# EAGLE design Preamp_Prueba (EAGLE 7.7.0)
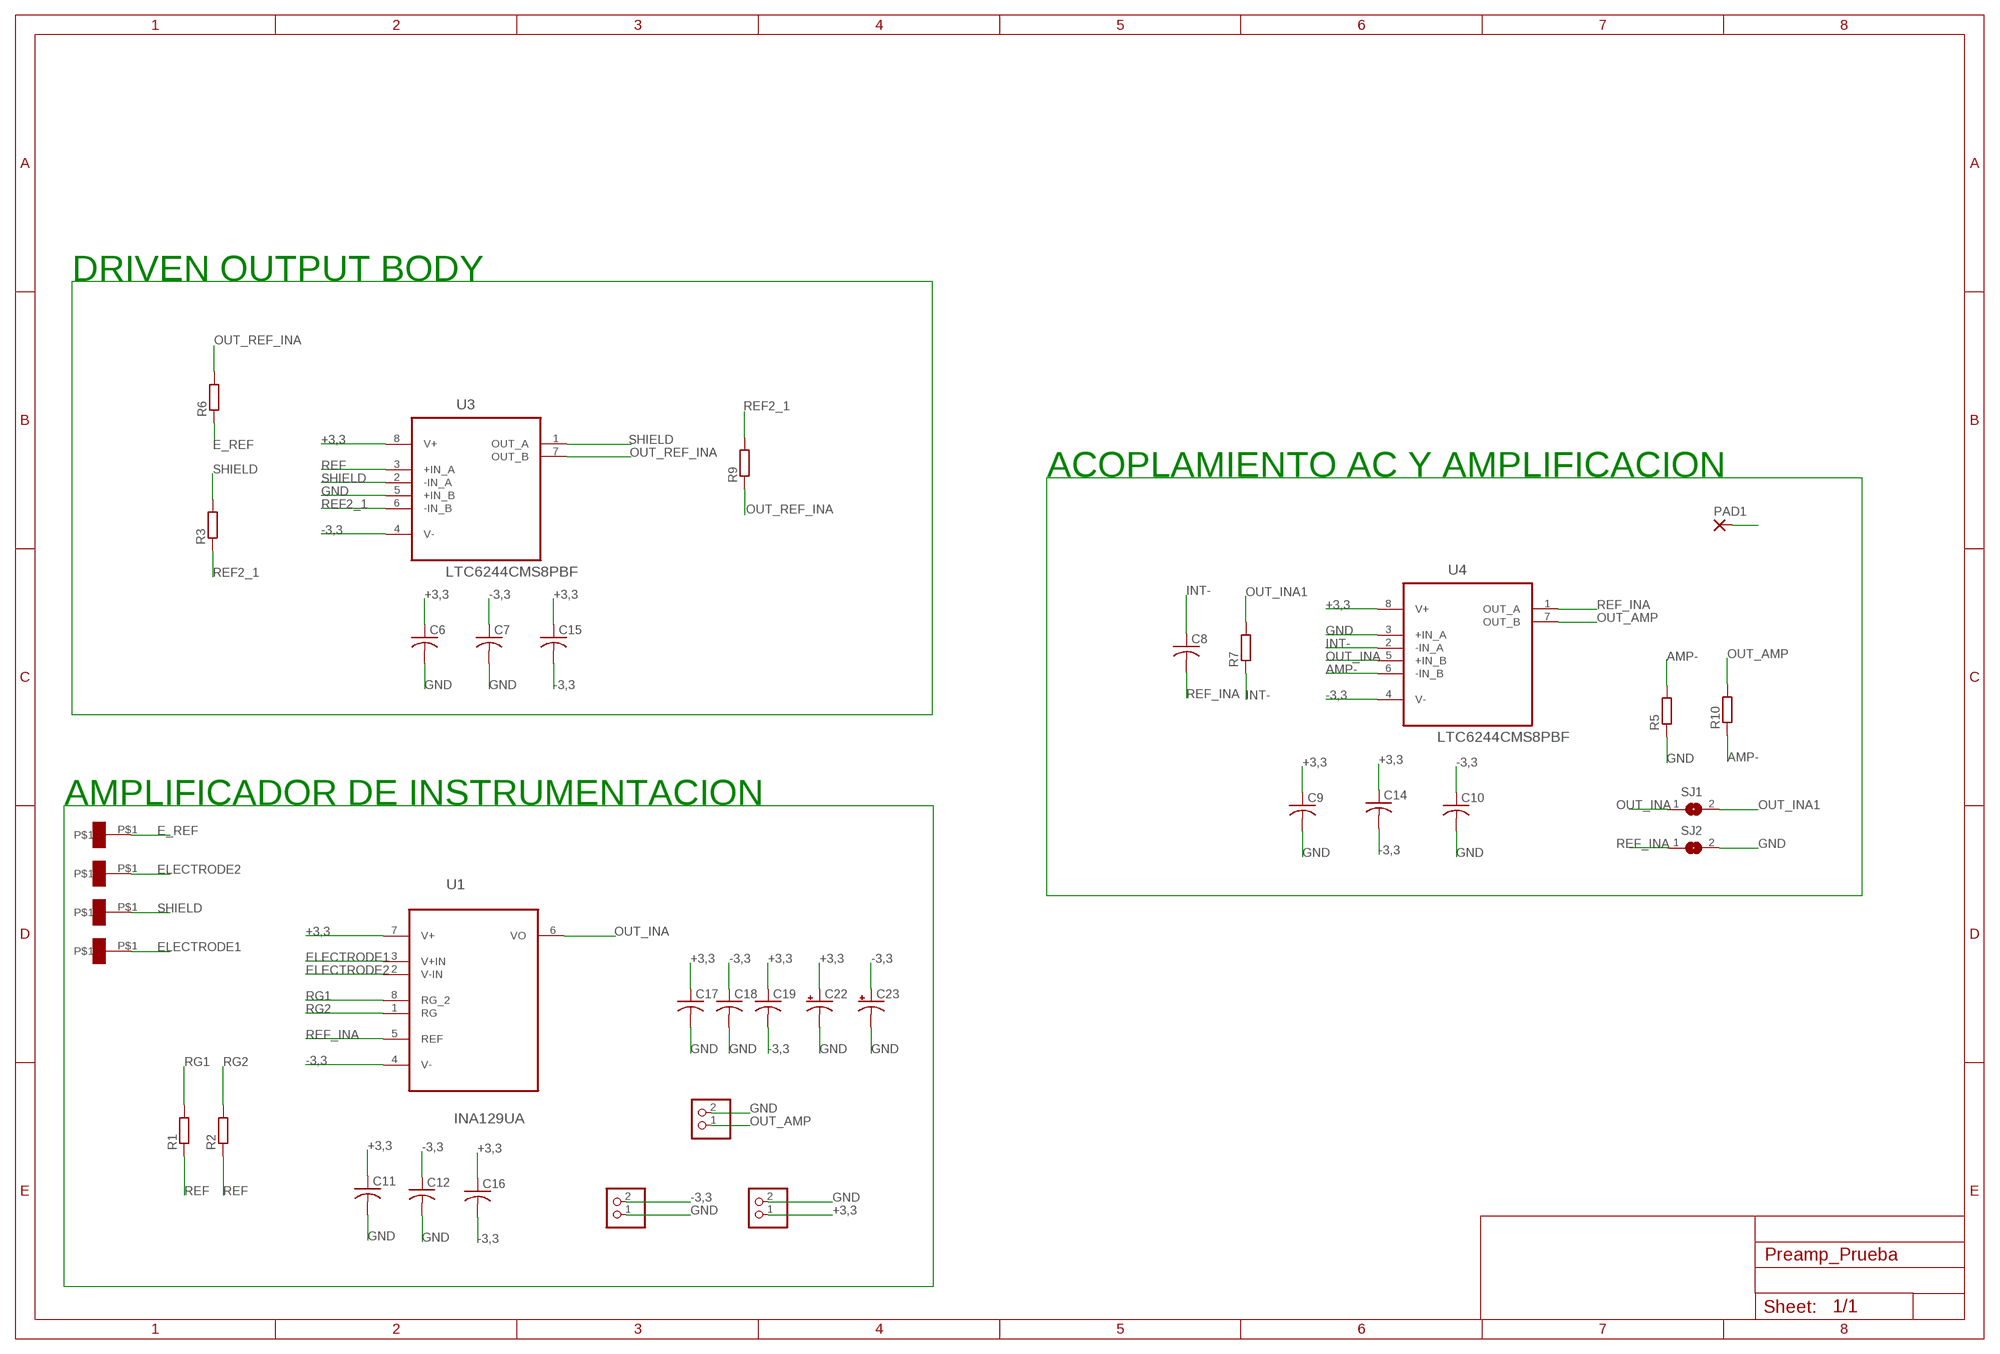
[diagram p0: schematic, sheet 1]

## Parts
C6  C-USC0805  [C0805]
C7  C-USC0805  [C0805]
C8  C-USC0805  [C0805]
C9  C-USC0805  [C0805]
C10  C-USC0805  [C0805]
C11  C-USC0805  [C0805]
C12  C-USC0805  [C0805]
C14  C-USC0805  [C0805]
C15  C-USC0805  [C0805]
C16  C-USC0805  [C0805]
C17  C-USC0805  [C0805]
C18  C-USC0805  [C0805]
C19  C-USC0805  [C0805]
C22  CPOL-USB/3528-21W  [B/3528-21W]
C23  CPOL-USB/3528-21W  [B/3528-21W]
JP1  PINHD-1X2  [1X02]
JP2  PINHD-1X2  [1X02]
JP5  PINHD-1X2  [1X02]
PAD1  SMD2  [SMD1,27-2,54]
R1  R-EU_R0805  [R0805]
R2  R-EU_R0805  [R0805]
R3  R-EU_R0805  [R0805]
R5  R-EU_R0805  [R0805]
R6  R-EU_R0805  [R0805]
R7  R-EU_R0805  [R0805]
R9  R-EU_R0805  [R0805]
R10  R-EU_R0805  [R0805]
SJ1  SJ  [SJ]
SJ2  SJ  [SJ]
U1  INA129UA  [SOIC127P600X175-8N]
U3  LTC6244CMS8PBF  [SOP65P490X110-8N]
U4  LTC6244CMS8PBF  [SOP65P490X110-8N]
U$1  PIN_E  [PIN]
U$2  PIN_E  [PIN]
U$3  PIN_E  [PIN]
U$4  PIN_E  [PIN]

## Nets
+3,3: C6.1 C9.1 C11.1 C14.1 C15.1 C16.1 C17.1 C19.1 C22.+ JP2.1 U1.7(V+) U3.8(V+) U4.8(V+)
-3,3: C7.1 C10.1 C12.1 C14.2 C15.2 C16.2 C18.1 C19.2 C23.+ JP1.2 U1.4(V-) U3.4(V-) U4.4(V-)
AMP-: R5.2 R10.1 U4.6(-IN_B)
E_REF: R6.1 U$3.P$1
ELECTRODE1: U1.3(V+IN) U$4.P$1
ELECTRODE2: U1.2(V-IN) U$2.P$1
GND: C6.2 C7.2 C9.2 C10.2 C11.2 C12.2 C17.2 C18.2 C22.- C23.- JP1.1 JP2.2 JP5.2 PAD1.1(P) R5.1 SJ2.2 U3.5(+IN_B) U4.3(+IN_A)
INT-: C8.1 R7.1 U4.2(-IN_A)
OUT_AMP: JP5.1 R10.2 U4.7(OUT_B)
OUT_INA: SJ1.1 U1.6(VO) U4.5(+IN_B)
OUT_INA1: R7.2 SJ1.2
OUT_REF_INA: R6.2 R9.1 U3.7(OUT_B)
REF: R1.1 R2.1 U3.3(+IN_A)
REF2_1: R3.1 R9.2 U3.6(-IN_B)
REF_INA: C8.2 SJ2.1 U1.5(REF) U4.1(OUT_A)
RG1: R1.2 U1.8(RG_2)
RG2: R2.2 U1.1(RG)
SHIELD: R3.2 U3.1(OUT_A) U3.2(-IN_A) U$1.P$1

## Notes on the sheet
- DRIVEN OUTPUT BODY
- ACOPLAMIENTO AC Y AMPLIFICACION
- AMPLIFICADOR DE INSTRUMENTACION

## Library data of the parts
C6-C12 C14-C19 = resistor:C-US: CAPACITOR, American symbol
C22 C23 = rcl:CPOL-US: POLARIZED CAPACITOR, American symbol
JP1 JP2 JP5 = pinhead:PINHD-1X2: PIN HEADER
PAD1 = wirepad:SMD2: SMD PAD
R1-R3 R5-R7 R9 R10 = resistor:R-EU_: RESISTOR, European symbol
SJ1 SJ2 = jumper:SJ: SMD solder JUMPER
U1 = INA129UA:INA129UA: INSTRUMENTATION AMPLIFIER; AVAILABILITY: Good; DESCRIPTION: Precision, Low Power Instrumentation Amplifiers 8-SOIC -40 to 125; MF: Texas Instruments; MP: INA129UA; PACKAGE: SOIC-8 Texas Instruments; PRICE: 5.97 USD
U3 U4 = LTC6244CMS8PBF:LTC6244CMS8PBF: Dual 50MHz, Low Noise,Rail-to-Rail, CMOS Op Amp; AVAILABILITY: Good; DESCRIPTION: LTC6244 - Dual 50MHz, Low Noise, Rail-to-Rail, CMOS Op Amp; MF: Linear Technology; MP: LTC6244CMS8#PBF; PACKAGE: MSOP-8 Linear Technology; PRICE: 2.34 USD
U$1-U$4 = pin_esa_vuelta:PIN_E

## Board
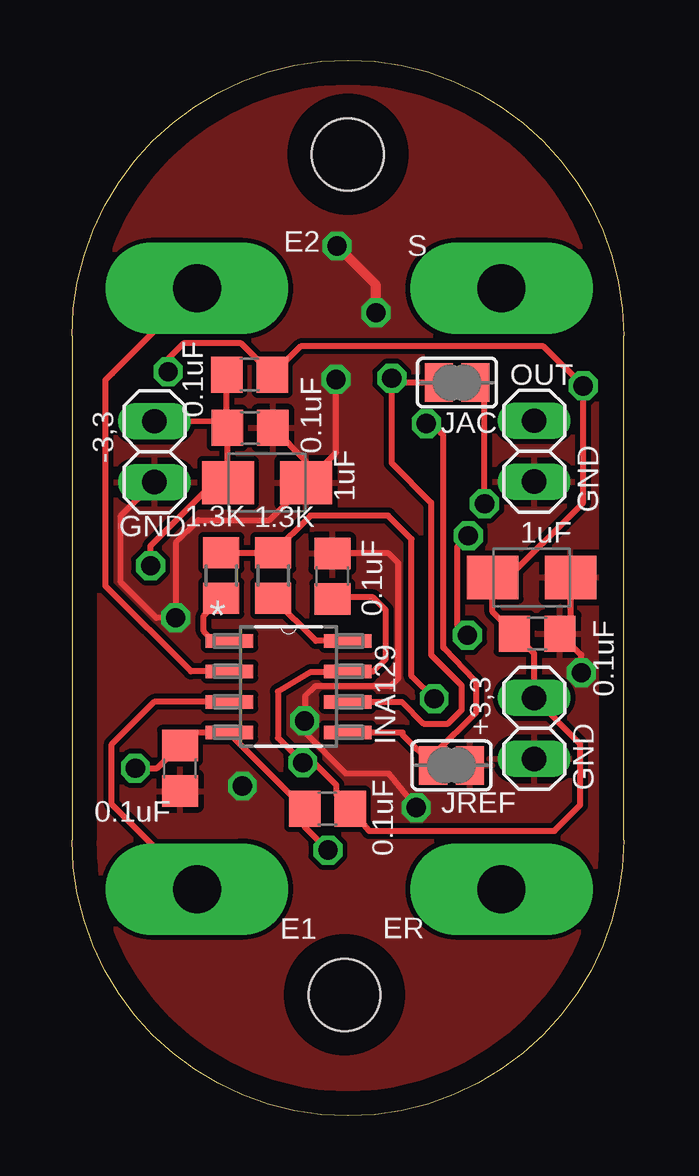
[diagram p1: board, top side]
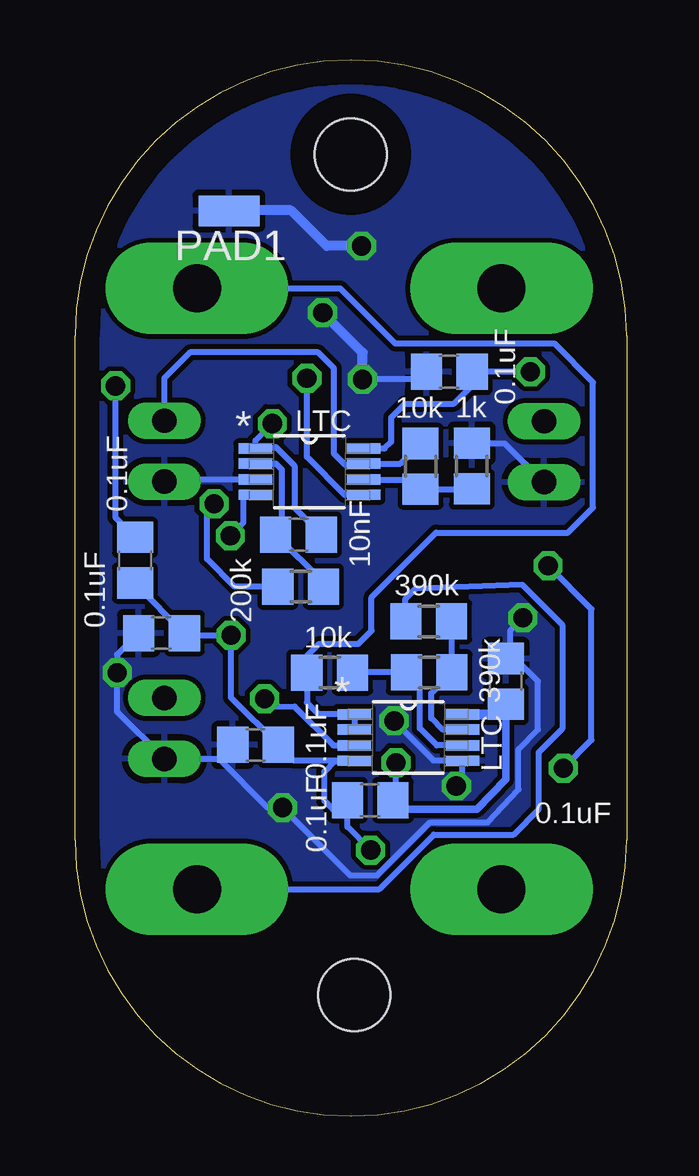
[diagram p2: board, bottom side, seen from below]

Size 23 x 44 mm. Coordinates in mm from the lower left corner, seen from the top.
Outline: 0,32.5 0,11.5 arc180 23,11.5 23,32.5 arc180 0,32.5
Copper layers (1*16): Top 0.035mm / dielectric 1.5mm / Bottom 0.035mm
Design rules "default": minimum track width 10mil, minimum drill 24mil, track to track 8mil, track to pad 8mil, pad to pad 8mil, via to via 8mil, smd to smd 8mil, copper to edge 40mil, drill to drill 8mil, minimum pad ring 10mil, minimum via ring 8mil, stop-mask expansion 4mil, vias tented up to drill 0mil, thermal gap 10mil
Holes 3 mm at 11.36,5.05 11.5,40.07

### Footprints (pad centres in the part's own frame; a part is rotated, then mirrored left to right if it is on the bottom)
C0805 = smd 1.3 x 1.5: 1 -0.95,0; 2 0.95,0
B/3528-21W = smd 2.15 x 1.8: + 1.625,0; - -1.625,0
1X02 = drill 1.016 long: 1 -1.27,0; 2 1.27,0
SMD1,27-2,54 = smd 1.27 x 2.54: 1 0,0
R0805 = smd 1.3 x 1.5: 1 -0.95,0; 2 0.95,0
SJ = smd 1.168 x 1.6: 1 -0.762,0; 2 0.762,0
SOIC127P600X175-8N = smd 1.981 x 0.559: 1 -2.464,1.905; 2 -2.464,0.635; 3 -2.464,-0.635; 4 -2.464,-1.905; 5 2.464,-1.905; 6 2.464,-0.635; 7 2.464,0.635; 8 2.464,1.905
SOP65P490X110-8N = smd 1.397 x 0.432: 1 -2.261,0.965; 2 -2.261,0.33; 3 -2.261,-0.33; 4 -2.261,-0.965; 5 2.261,-0.965; 6 2.261,-0.33; 7 2.261,0.33; 8 2.261,0.965
PIN = drill 2 pad 3.81 long: P$1 0,0

### Placement (x,y rotation side)
C6  5.04,18.11 90 bottom
C7  15.47,15.46 180 bottom
C8  13.68,24.22 0 bottom
C9  7.39,31.01 180 bottom
C10  19.39,20.12 180 bottom
C11  19.39,20.1 0 top
C12  4.5,14.49 270 top
C14  20.49,23.16 270 bottom
C15  10.69,13.16 180 bottom
C16  10.65,12.8 180 top
C17  10.85,22.49 90 top
C18  7.42,28.67 0 top
C19  7.4,30.89 180 top
C22  19.16,22.44 180 top
C23  8.13,26.39 180 top
JP1  3.44,27.68 90 top
JP2  19.27,16.15 270 top
JP5  19.27,27.7 270 top
PAD1  16.58,37.71 90 bottom
R1  8.39,22.52 270 top
R2  6.22,22.52 270 top
R3  12.38,18.47 180 bottom
R5  6.45,27.08 270 bottom
R6  8.25,20.61 0 bottom
R7  13.59,22.06 180 bottom
R9  8.23,18.48 180 bottom
R10  8.59,27.07 90 bottom
SJ1  16.05,30.56 0 top
SJ2  15.82,14.61 0 top
U1  9.03,17.89 0 top
U3  9.1,15.77 0 bottom
U4  13.22,26.85 0 bottom
U$1  17.91,34.48 180 top
U$2  5.21,34.48 180 top
U$3  17.91,9.45 0 top
U$4  5.21,9.45 0 top

### Tracks (layer width: path | path; a pad name or v marks a point on that pad's centre or on a via)
+3,3  (via drill 0.8)
  Top 0.254: C17.1 10.92,21.61 12.55,21.61 13.08,21.08 13.08,19.04 12.56,18.52 U1.7 11.47,18.5 9.95,18.5 8.58,17.69 8.58,15.76 v9.62,14.72 10.09,14.72 11.01,13.8 11.01,13.39 C16.1 | 11.64,12.84 C16.1 | 11.6,12.88 C16.1 | 11.54,12.8 C16.1 | C16.1 12.39,11.88 20.11,11.88 21.18,12.95 21.18,15.51 JP2.1 19.27,19.27 C11.1 17.54,21 C22.+ 17.86,22.08 17.86,22.11 21.31,25.56 v21.31,30.42 19.66,32.07 9.53,32.07 C19.1 7.05,32.19 4.65,32.19 4.01,31.55 v4.01,31.01
  Bottom 0.254: 9.72,12.74 C15.1 9.62,12.92 v9.62,14.72 | U4.8 10.09,27.82 9.81,28.09 9.81,29.11 9.24,29.68 7.19,29.68 6.47,30.4 6.47,30.98 C9.1 v4.01,31.01 | U3.8 6.05,16.73 | C14.1 21.31,24.93 v21.31,30.42
  Bottom 0.305: C6.1 5.04,14.03 6.25,12.79 9.71,12.79 C15.1
  Bottom 0.406: 6.05,16.73 5.05,16.73 C6.1
-3,3  (via drill 0.8)
  Top 0.254: 9.68,12.78 C16.2 | JP1.2 6.17,28.97 | 6.17,28.97 C18.1 6.47,26.43 C23.+ 5.9,26.39 3.27,23.76 v3.27,22.93 | v16.49,20.03 16.05,20.47 16.05,23.71 v16.52,24.18 | 6.17,28.97 6.45,29.25 C19.2 | U1.4 6.52,15.98 C16.2 | 6.57,15.93 U1.4 | U1.4 5.04,15.98 C12.1 3.55,14.49 v2.64,14.49 | C16.2 9.7,12.05 v10.67,11.08
  Bottom 0.254: U4.4 15.97,25.89 15.97,24.73 v16.52,24.18 | v10.67,11.08 11.64,12.05 C15.2 12.25,12.78 12.6,13.13 12.6,14.35 12.17,14.78 11.38,14.78 U3.4 13.87,14.8 C7.1 16.49,17.43 v16.49,20.03 18.35,20.03 C10.1 20.45,22.13 C14.2 | v2.64,14.49 1.46,15.67 1.46,21.12 v3.27,22.93
AMP-
  Bottom 0.254: U4.6 8.99,26.52 R10.1 R5.2
E_REF
  Bottom 0.254: R6.1 9.23,20.64 9.23,21.53 8.8,21.96 4.34,22.13 2.68,20.47 2.68,16.13 3.66,15.15 3.66,12.78 4.7,11.72 8.04,11.72 10.31,9.45 U$3.P$1
ELECTRODE1
  Top 0.254: U1.3 3.43,17.25 1.66,15.49 1.66,13 U$4.P$1
ELECTRODE2
  Top 0.254: U1.2 4.96,18.52 1.4,22.08 1.4,30.67 1.47,30.74 1.67,30.95 U$2.P$1
GND  (via drill 0.8)
  Top 0.254: C17.2 13.2,23.44 13.6,23.04 13.6,18.22 13.28,17.9 10.12,17.9 9.72,17.5 9.72,16.49 v9.69,16.46 9.69,16 11.41,14.28 13.2,14.28 v14.35,12.85 | C18.2 9.76,27.29 C23.- | C23.- 11.01,27.64 v11.01,30.69 | v21.24,18.47 21.24,19.2 C11.2 20.79,20.54 C22.- | C23.- 9.76,26.36 8.23,24.83 5.27,24.83 4.32,23.88 v4.32,20.76 3.51,20.76 2.03,22.24 2.03,25 JP1.1
  Top 0.406: v12.67,33.47 12.67,34.63 v11.05,36.25
  Bottom 0.254: 17,14.88 JP2.2 21.24,16.85 v21.24,18.47 21.24,19.22 C10.2 | 17,14.88 C7.2 16.84,15.04 | C9.2 8.66,30.69 v11.01,30.69 | R5.1 5.09,28.03 JP1.1 | v9.69,16.46 8.06,14.84 8.06,14.8 U3.5 6.84,14.01 v7.1,13.75 | 4.44,18.86 3.69,18.11 3.69,16.11 4.51,15.29 4.51,13.61 5.8,12.23 8.2,12.23 10.4,10.03 11.53,10.03 v14.35,12.85 14.97,12.85 17,14.88 | C6.2 4.84,18.86 4.84,20.24 v4.32,20.76 | U4.3 19.27,26.52 JP5.2
  Bottom 0.406: v11.01,30.69 11.01,31.81 v12.67,33.47 | v11.05,36.25 12.51,36.25 13.99,37.73 16.56,37.73 PAD1.1
  pour Top: 0.09,32.48 0.09,32.82 arc-90 11.23,43.96 11.57,43.96 arc-90 23.01,32.52 23.01,11.52 arc-90 11.44,-0.05 arc-90 0.09,11.3
  pour Bottom: 22.95,32.46 22.95,32.8 arc90 11.81,43.94 11.47,43.94 arc90 0.03,32.5 0.03,11.5 arc90 11.6,-0.07 arc90 22.95,11.28
INT-
  Bottom 0.254: U4.2 14.62,27.18 14.38,26.94 14.38,24.47 C8.1 12.64,22.23 R7.1
OUT_AMP
  Bottom 0.254: R10.2 9.43,27.18 U4.7 11,27.14 11.75,27.14 12.21,27.59 12.21,31.16 12.86,31.82 18.2,31.82 19.28,30.74 JP5.1
OUT_INA  (via drill 0.8)
  Top 0.254: U1.6 13.76,17.25 14.66,16.35 15.68,16.35 16.25,16.92 16.25,17.93 14.97,19.21 14.97,25.56 13.33,27.2 v13.33,30.74 13.5,30.56 SJ1.1
  Bottom 0.254: U4.5 11.76,25.89 13.33,27.46 v13.33,30.74
OUT_INA1  (via drill 0.8)
  Top 0.254: v17.2,25.51 17.2,30.17 SJ1.2
  Bottom 0.254: R7.2 16.34,22.06 17.49,23.21 17.49,25.22 v17.2,25.51
OUT_REF_INA
  Bottom 0.254: U3.7 7.67,16.1 8.14,16.57 8.14,17.62 R9.1 7.28,20.59 R6.2
REF  (via drill 0.8)
  Top 0.254: R2.1 R1.1 9.94,25.02 13.18,25.02 14.16,24.04 14.16,18.32 v15.1,17.38
  Bottom 0.254: v15.1,17.38 14.88,17.08 13.84,17.06 12.22,15.44 U3.3
REF2_1
  Bottom 0.254: 9.12,18.42 R9.2 | R9.2 R3.1 | U3.6 7.91,15.44 8.62,16.15 8.62,17.92 R9.2
REF_INA  (via drill 0.8)
  Top 0.254: U1.5 13.78,15.98 13.78,15.88 SJ2.1 15.13,15.11 16.85,16.83 16.85,18.09 16.78,18.16 15.53,19.47 15.48,19.52 15.48,28.36 15.38,28.46 14.99,28.85 v14.77,28.85
  Bottom 0.254: C8.2 13.87,25.36 13.85,25.37 13.85,27.1 14.62,27.87 U4.1 15.48,28.14 v14.77,28.85
RG1
  Top 0.254: U1.8 10.17,19.79 R1.2
RG2
  Top 0.254: U1.1 5.9,19.79 5.49,20.2 5.49,20.84 R2.2
SHIELD
  Bottom 0.254: U3.2 11.34,16.12 11.34,16.71 U3.1 11.38,16.75 12.86,16.75 13.33,17.22 R3.2 13.44,18.58 13.44,19.05 12.82,19.67 11.18,19.67 10.63,20.22 10.63,21.62 7.94,24.31 2.44,24.31 1.4,25.35 1.4,30.57 3.02,32.19 9.65,32.19 11.94,34.48 U$1.P$1

### Text on the board
tPlace: E2 | S | OUT | 0.1uF | JAC | -3,3 | 0.1uF | GND | 1uF | GND | 1.3K | 1.3K | 1uF | 0.1uF | 0.1uF | INA129 | +3,3 | GND | 0.1uF | JREF | 0.1uF | E1 | ER
bPlace: 0.1uF | 1k | 10k | LTC | 0.1uF | 10nF | 390k | 200k | 0.1uF | 10k | 390k | LTC | 0.1uF | 0.1uF | 0.1uF